# Altium project ESP12Ebreakout_v2.PrjPcb
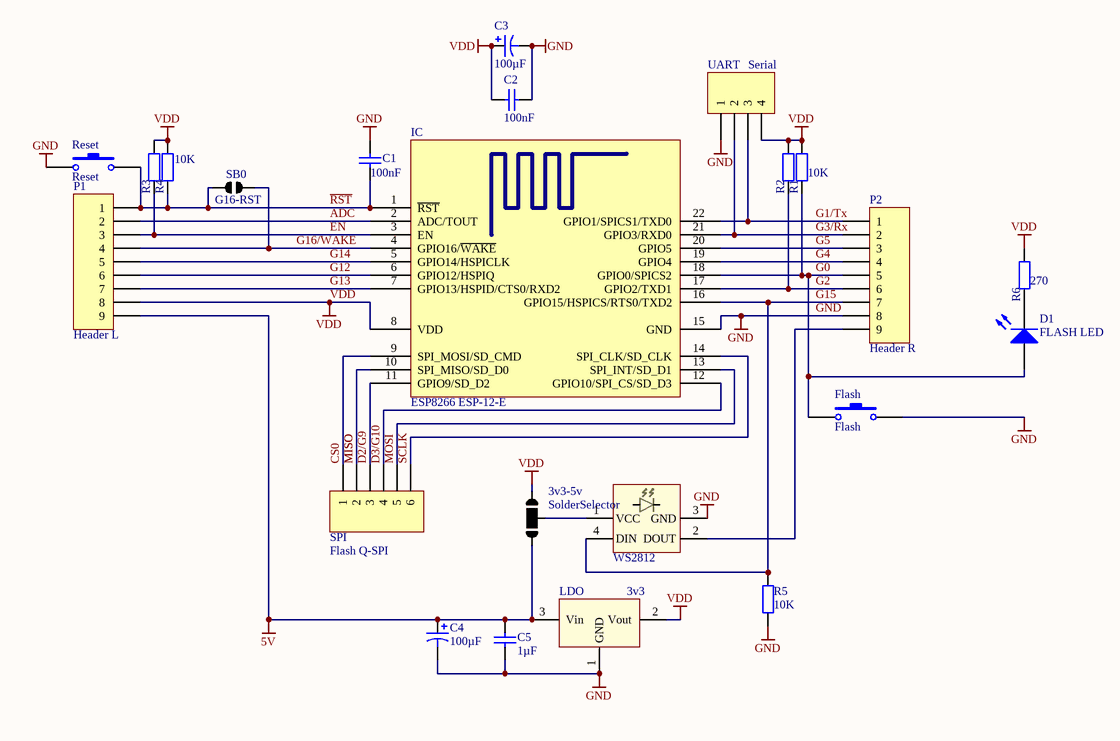
[diagram p0: Schematic.SchDoc]
1 sheet, 23 parts. Net scope: global (net labels, ports and power ports of the same name join across sheets).
Board files: ESP12E-v2.PcbDoc, Panel.PcbDoc

## Sheet Schematic.SchDoc
size A4

### Parts
3v3-5v  SolderSelector  [SolderSelector]
C1  value 100nF  [C1206]  (hidden comment: Cap Semi)
C2  value 100nF  [C1206]  (hidden comment: Cap Semi)
C3  value 100µF  [SMD cap 6x5]
C4  value 100µF  [SMD cap 6x5]
C5  value 1µF  [C1206]
D1  FLASH LED  [C1206]
Flash  Flash  [SMDswitch]
IC  ESP8266 ESP-12-E  [ESP8266 ESP-12-E]
LDO  3v3  [SOT-23A]
P1  Header L  [HDR1X9]
P2  Header R  [HDR1X9]
R1  value 10K  [C1206]  (hidden comment: Res2)
R2  Res2  [C1206]  (value not drawn)
R3  value 10K  [C1206]  (hidden comment: Res2)
R4  Res2  [C1206]  (value not drawn)
R5  value 10K  [C1206]  (hidden comment: Res2)
R6  value 270  [C1206]  (hidden comment: Res2)
Reset  Reset  [SMDswitch]
SB0  G16-RST  [SolderBridge]
SPI  Flash Q-SPI  [HDR1X6]
UART  Serial  [HDR1X4]
WS2812  WS2812  [WS2812B]  (value not drawn)

### Nets
5V: 3v3-5v.1 C4.1 C5.2 LDO.3(Vin) P1.9
GND: C1.2 C2.2 C3.2 C4.2 C5.1 Flash.2 IC.15(GND) LDO.1(GND) P2.8 R5.1 Reset.1 UART.1 WS2812.3(GND)
VDD: 3v3-5v.0 C2.1 C3.1 IC.8(VDD) LDO.2(Vout) P1.8 R1.2 R2.2 R3.2 R4.2 R6.2 UART.4
ADC: IC.2(ADC/TOUT) P1.2
CS0: IC.9(SPI_MOSI/SD_CMD) SPI.1
D2/G9: IC.11(GPIO9/SD_D2) SPI.3
D3/G10: IC.12(GPIO10/SPI_CS/SD_D3) SPI.4
EN: IC.3(EN) P1.3 R3.1
G0: D1.1(A) Flash.1 IC.18(GPIO0/SPICS2) P2.5 R1.1
G1/Tx: IC.22(GPIO1/SPICS1/TXD0) P2.1 UART.3
G2: IC.17(GPIO2/TXD1) P2.6 R2.1
G3/Rx: IC.21(GPIO3/RXD0) P2.2 UART.2
G4: IC.19(GPIO4) P2.4
G5: IC.20(GPIO5) P2.3
G12: IC.6(GPIO12/HSPIQ) P1.6
G13: IC.7(GPIO13/HSPID/CTS0/RXD2) P1.7
G14: IC.5(GPIO14/HSPICLK) P1.5
G15: IC.16(GPIO15/HSPICS/RTS0/TXD2) P2.7 R5.2 WS2812.4(DIN)
G16/~{WAKE}: IC.4(GPIO16/~{WAKE}) P1.4 SB0.1
MISO: IC.10(SPI_MISO/SD_D0) SPI.2
MOSI: IC.13(SPI_INT/SD_D1) SPI.5
~{RST}: C1.1 IC.1(~{RST}) P1.1 R4.1 Reset.2 SB0.0
SCLK: IC.14(SPI_CLK/SD_CLK) SPI.6
Net3v3-5v_2: 3v3-5v.2 WS2812.1(VCC)
NetD1_2: D1.2(K) R6.1
NetP2_9: P2.9 WS2812.2(DOUT)

### Library data of the parts
C1 C2 = Cap Semi: Capacitor (Semiconductor SIM Model); Published: 8-Jun-2000; LatestRevisionDate: 29-May-2009; LatestRevisionNote: IPC-7351 Footprint Added.; PackageReference: C1206; Publisher: Altium Limited; PackageDescription: Chip Capacitor
C3 C4 = Cap Pol1: Polarized Capacitor (Radial); Published: 8-Jun-2000; LatestRevisionDate: 17-Jul-2002; LatestRevisionNote: Re-released for DXP Platform.; PackageReference: RB7.6-15; Publisher: Altium Limited; PackageDescription: Polarized Capacitor (Radial); 2 Leads
C5 = Cap: Capacitor; Published: 8-Jun-2000; LatestRevisionDate: 17-Jul-2002; LatestRevisionNote: Re-released for DXP Platform.; PackageReference: RAD-0.3; Publisher: Altium Limited; PackageDescription: Radial Cap, Thru-Hole; 2 Leads; 0.3 in Pin Spacing
D1 = LED2: Typical RED, GREEN, YELLOW, AMBER GaAs LED; Published: 8-Jun-2000; LatestRevisionDate: 17-Jul-2002; LatestRevisionNote: Re-released for DXP Platform.; PackageVersion: Feb-2002; PackageReference: 3.2X1.6X1.1; Publisher: Altium Limited; PackageDescription: SM LED; 2 Flat Leads
Flash Reset = SW-PB: Switch; Published: 24-Mar-1999; LatestRevisionDate: 17-Jul-2002; LatestRevisionNote: Re-released for DXP Platform.; PackageReference: SPST-2; Publisher: Altium Limited; PackageDescription: Switch; 2 Leads
LDO = MCP1703: Power regulator
P1 P2 = Header 9: Header, 9-Pin; LatestRevisionDate: 17-Jul-2002; LatestRevisionNote: Re-released for DXP Platform.; Publisher: Altium Limited
R1 R3 R5 R6 = Res2: Resistor; Published: 8-Jun-2000; LatestRevisionDate: 17-Jul-2002; LatestRevisionNote: Re-released for DXP Platform.; PackageReference: AXIAL-0.4; Publisher: Altium Limited; PackageDescription: Axial Device, Thru-Hole; 2 Leads; 0.4 in Pin Spacing
R2 R4 = Res2: Resistor; Value: 10K; Published: 8-Jun-2000; LatestRevisionDate: 17-Jul-2002; LatestRevisionNote: Re-released for DXP Platform.; PackageReference: AXIAL-0.4; Publisher: Altium Limited; PackageDescription: Axial Device, Thru-Hole; 2 Leads; 0.4 in Pin Spacing
SB0 = SolderBridge
SPI = Header 6: Header, 6-Pin; LatestRevisionDate: 17-Jul-2002; LatestRevisionNote: Re-released for DXP Platform.; Publisher: Altium Limited
UART = Header 4: Header, 4-Pin; LatestRevisionDate: 17-Jul-2002; LatestRevisionNote: Re-released for DXP Platform.; Publisher: Altium Limited
WS2812 = WS2812: Serial RGB Led